# EAGLE schematic smart-tps (EAGLE 9.6.2)
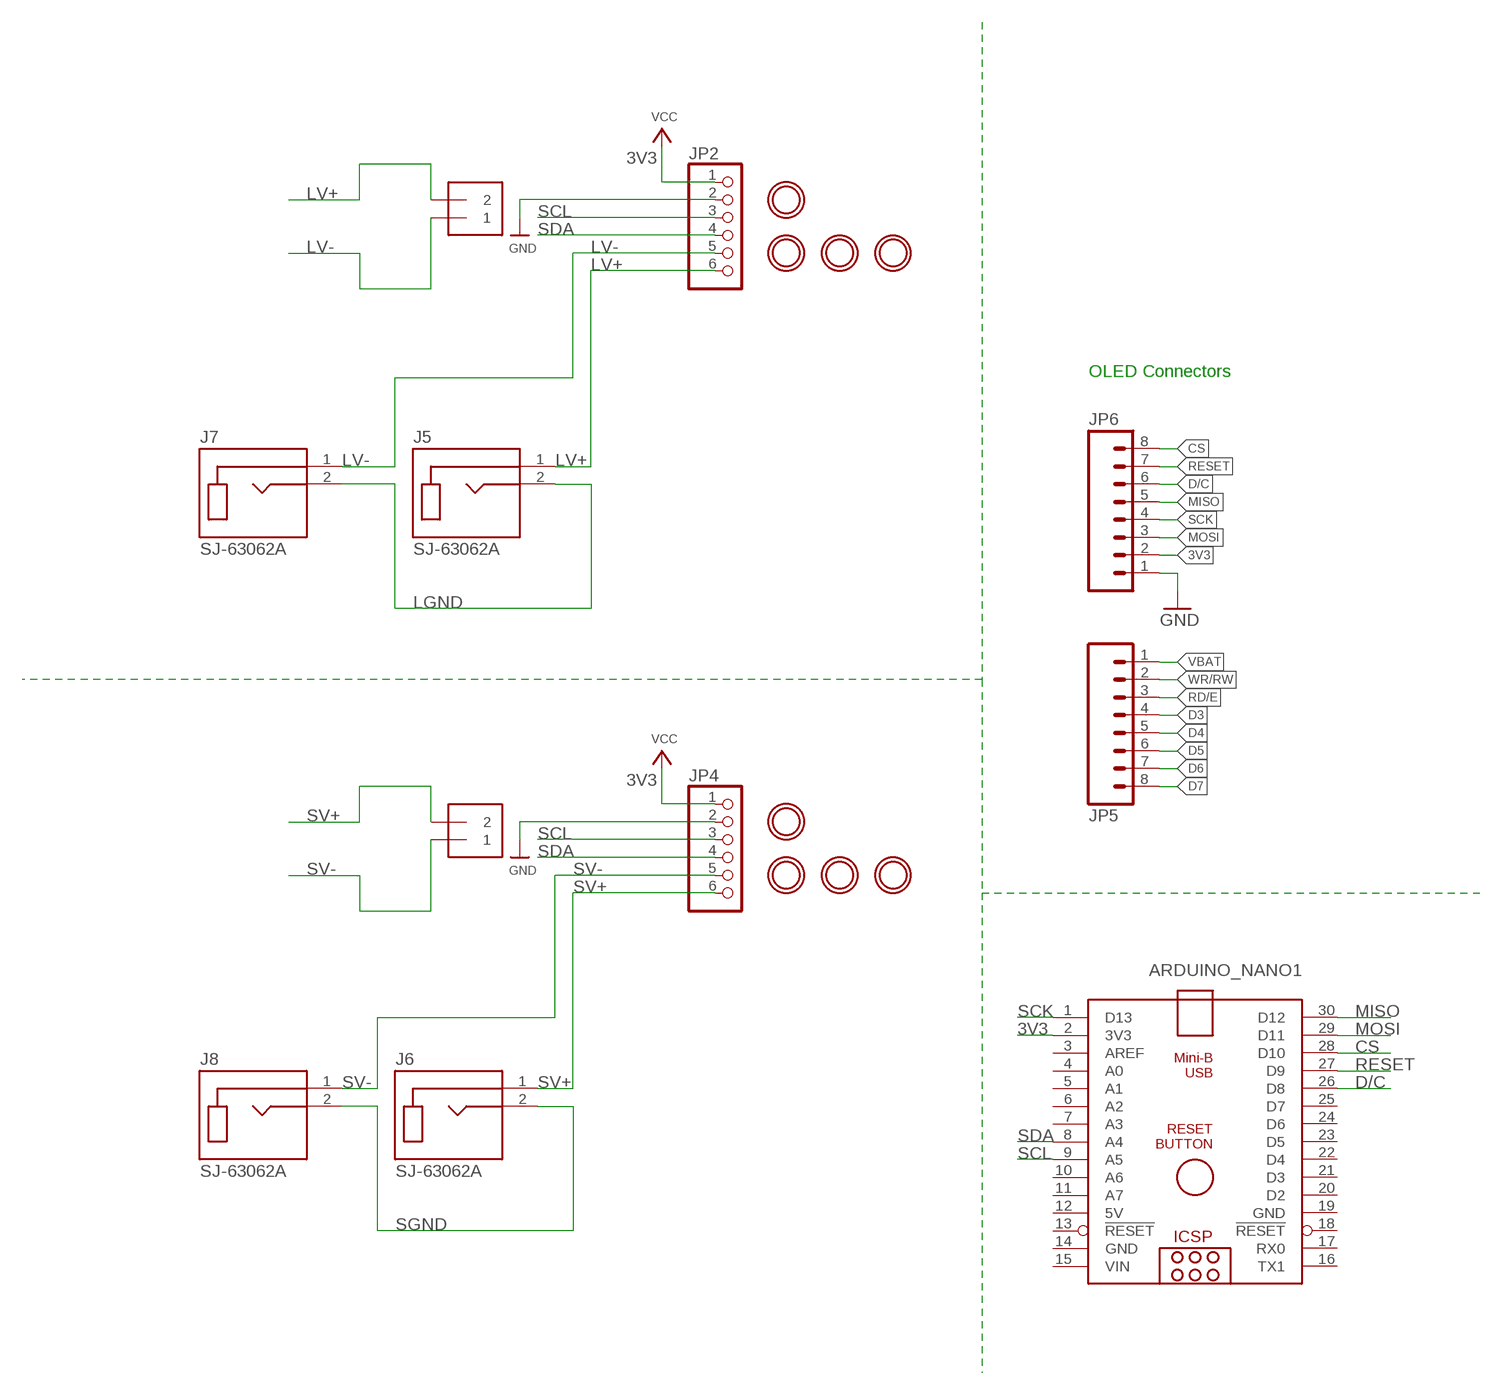
[diagram p0: schematic, sheet 1, part 1 of 2]
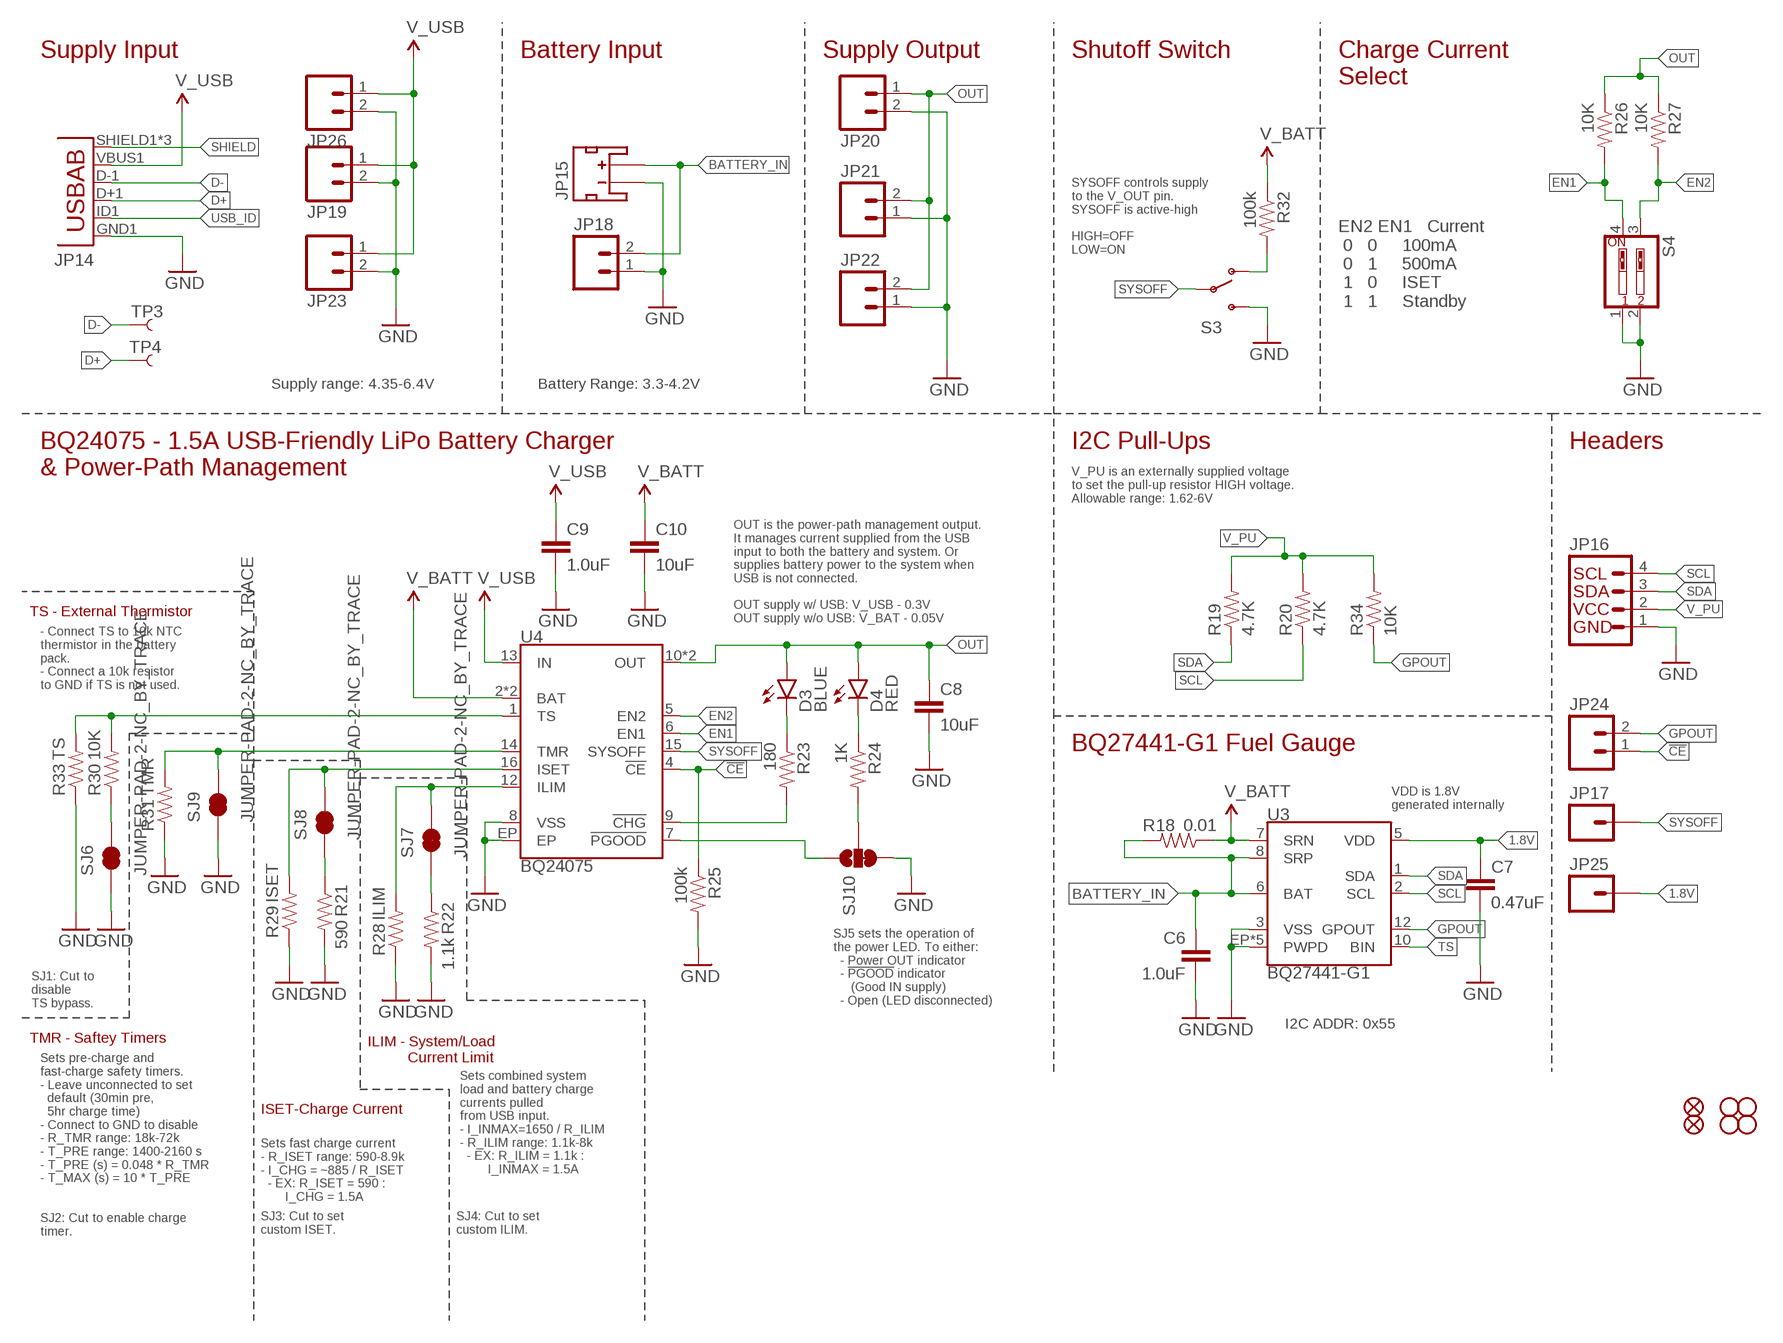
[diagram p1: schematic, sheet 1, part 2 of 2]

## Parts
ARDUINO_NANO1  ARDUINO_NANO  [ARDUINO_NANO]
C6  1.0uF  1.0UF-16V-10%(0603)  [0603-CAP]
C7  0.47uF  CAP0603-CAP  [0603-CAP]
C8  10uF  10UF10V10%(0805)  [0805-CAP]
C9  1.0uF  1.0UF50V10%(1206)  [1206-CAP]
C10  10uF  10UF10V10%(0805)  [0805-CAP]
D3  BLUE  LED-BLUE0603  [LED-0603]
D4  RED  LED-RED0603  [LED-0603]
FID3  FIDUCIAL1X2  [FIDUCIAL-1X2]
FID4  FIDUCIAL1X2  [FIDUCIAL-1X2]
J2  TERMBLOCK_1X2-3.5MM  [1X2-3.5MM]
J4  TERMBLOCK_1X2-3.5MM  [1X2-3.5MM]
J5  SJ-63062A  [CUI_SJ-63062A]
J6  SJ-63062A  [CUI_SJ-63062A]
J7  SJ-63062A  [CUI_SJ-63062A]
J8  SJ-63062A  [CUI_SJ-63062A]
JP2  HEADER-1X670MIL  [1X06_ROUND_70]
JP4  HEADER-1X670MIL  [1X06_ROUND_70]
JP5  M08  [1X08_PIN1_NO_SILK]
JP6  M08  [1X08_PIN1_NO_SILK]
JP14  USB-ABCONN-11794  [USB-AB-MICRO-SMD_V03]
JP15  JST_2MM_MALE  [JST-2-SMD]
JP16  I2C_STANDARD_NO_SILK  [1X04_NO_SILK]
JP17  M01PTH_NO_SILK_YES_STOP  [1X01_NO_SILK]
JP18  M021X02_NO_SILK  [1X02_NO_SILK@1]
JP19  M023.5MM-NO_SILK  [SCREWTERMINAL-3.5MM-2-NS@1]
JP20  M023.5MM-NO_SILK  [SCREWTERMINAL-3.5MM-2-NS@1]
JP21  M021X02_NO_SILK  [1X02_NO_SILK@1]
JP22  M02-JST-2-PTH-NO_SILK  [JST-2-PTH-NS@1]
JP23  M021X02_NO_SILK  [1X02_NO_SILK@1]
JP24  M021X02_NO_SILK  [1X02_NO_SILK@1]
JP25  M01PTH_NO_SILK_YES_STOP  [1X01_NO_SILK]
JP26  M021X02_NO_SILK  [1X02_NO_SILK@1]
R18  0.01  RESISTOR1206  [1206]
R19  4.7K  4.7KOHM-1/10W-1%(0603)  [0603-RES]
R20  4.7K  4.7KOHM-1/10W-1%(0603)  [0603-RES]
R21  590  RESISTOR0603-RES  [0603-RES]
R22  1.1k  RESISTOR0603-RES  [0603-RES]
R23  180  180OHM1/10W1%(0603)  [0603-RES]
R24  1K  1KOHM-1/10W-1%(0603)  [0603-RES]
R25  100k  100KOHM-1/10W-1%(0603)  [0603-RES]
R26  10K  10KOHM-1/10W-1%(0603)0603  [0603-RES]
R27  10K  10KOHM-1/10W-1%(0603)0603  [0603-RES]
R28  ILIM  RESISTORPTH-1/6W  [1/6W-RES]
R29  ISET  RESISTORPTH-1/6W  [1/6W-RES]
R30  10K  10KOHM-1/10W-1%(0603)0603  [0603-RES]
R31  TMR  RESISTORPTH-1/6W  [1/6W-RES]
R32  100k  100KOHM-1/10W-1%(0603)  [0603-RES]
R33  TS  RESISTORPTH-1/6W  [1/6W-RES]
R34  10K  10KOHM-1/10W-1%(0603)0603  [0603-RES]
S3  SWITCH-SPDT-SMD-A  [SWITCH-SPST-SMD-A]
S4  SW_DIP-2-SMT-HALFSIZE  [DIPSWITCH-02-50MIL]
SJ6  JUMPER-PAD-2-NC_BY_TRACE  [PAD-JUMPER-2-NC_BY_TRACE_YES_SILK]
SJ7  JUMPER-PAD-2-NC_BY_TRACE  [PAD-JUMPER-2-NC_BY_TRACE_YES_SILK]
SJ8  JUMPER-PAD-2-NC_BY_TRACE  [PAD-JUMPER-2-NC_BY_TRACE_YES_SILK]
SJ9  JUMPER-PAD-2-NC_BY_TRACE  [PAD-JUMPER-2-NC_BY_TRACE_YES_SILK]
SJ10  JUMPER-PAD-3-2OF3_NC_BY_TRACE_SMALL  [PAD-JUMPER-3-2OF3_NC_BY_TRACE_YES_SILK_FULL_BOX]
STANDOFF5  STAND-OFF  [STAND-OFF]
STANDOFF6  STAND-OFF  [STAND-OFF]
STANDOFF7  STAND-OFF  [STAND-OFF]
STANDOFF8  STAND-OFF  [STAND-OFF]
TP3  TEST-POINT3X4  [PAD.03X.04]
TP4  TEST-POINT3X4  [PAD.03X.04]
U3  BQ27441-G1  [PDSO-N12]
U4  BQ24075  [PVQFN-N16]
U$18  MOUNTINGHOLE2.5  [MOUNTINGHOLE_2.5_PLATED]
U$19  MOUNTINGHOLE2.5  [MOUNTINGHOLE_2.5_PLATED]
U$20  MOUNTINGHOLE2.5  [MOUNTINGHOLE_2.5_PLATED]
U$21  MOUNTINGHOLE2.5  [MOUNTINGHOLE_2.5_PLATED]
U$40  MOUNTINGHOLE2.5  [MOUNTINGHOLE_2.5_PLATED]
U$41  MOUNTINGHOLE2.5  [MOUNTINGHOLE_2.5_PLATED]
U$42  MOUNTINGHOLE2.5  [MOUNTINGHOLE_2.5_PLATED]
U$43  MOUNTINGHOLE2.5  [MOUNTINGHOLE_2.5_PLATED]

## Nets
1.8V: C7.1 JP25.1 U3.5(VDD)
3V3 [power_supply]: ARDUINO_NANO1.2(3V3) JP2.1 JP4.1 JP6.2 ; supply symbol labelled VCC
!CE!: JP24.1 R25.1 U4.4(!CE!)
!CHG!1: R23.2 U4.9(!CHG!)
!PGOOD!1: SJ10.1 U4.7(!PGOOD!)
BATTERY_IN: C6.1 JP15.2(+) JP18.2 R18.2 U3.6(BAT) U3.8(SRP)
CS: ARDUINO_NANO1.28(D10) JP6.8
D3: JP5.4
D4: JP5.5
D5: JP5.6
D6: JP5.7
D7: JP5.8
D+: JP14.D+1(D+) TP4.P$1
D-: JP14.D-1(D-) TP3.P$1
D/C: ARDUINO_NANO1.26(D8) JP6.6
EN1: R26.2 S4.4 U4.6(EN1)
EN2: R27.2 S4.3 U4.5(EN2)
GND: C6.2 C7.2 C8.2 C9.2 C10.2 JP2.2 JP4.2 JP6.1 JP14.GND1(GND) JP15.1(-) JP16.1 JP18.1 JP19.2 JP20.2 JP21.1 JP22.1 JP23.2 JP26.2 R21.2 R22.2 R25.2 R28.1 R29.1 R31.1 R33.1 S3.3(S) S4.1 S4.2 SJ6.1 SJ9.1 SJ10.3 U3.3(VSS) U3.EP1(PWPD) U3.EP2(PWPD) U3.EP3(PWPD) U3.EP4(PWPD) U3.EP(PWPD) U4.8(VSS) U4.EP
GPOUT: JP24.2 R34.1 U3.12(GPOUT)
ILIM1: R28.2 SJ7.2 U4.12(ILIM)
ISET1: R29.2 SJ8.2 U4.16(ISET)
LGND [tool_power]: J5.2(TIP) J7.2(TIP)
LV+ [tool_power]: J2.2 J5.1(SLEEVE) JP2.6
LV- [tool_power]: J2.1 J7.1(SLEEVE) JP2.5
MISO: ARDUINO_NANO1.30(D12) JP6.5
MOSI: ARDUINO_NANO1.29(D11) JP6.3
N$6: D3.C R23.1
N$7: D4.C R24.1
N$8: R32.2 S3.1(O)
N$9: R30.1 SJ6.2
N$10: R22.1 SJ7.1
N$13: R21.1 SJ8.1
N$14: R24.2 SJ10.2
OUT: C8.1 D3.A D4.A JP20.1 JP21.2 JP22.2 R26.1 R27.1 U4.10(OUT) U4.11(OUT)
RD/E: JP5.3
RESET: ARDUINO_NANO1.27(D9) JP6.7
SCK: ARDUINO_NANO1.1(D13) JP6.4
SCL: ARDUINO_NANO1.9(A5) JP2.3 JP4.3 JP16.4 R20.1 U3.2(SCL)
SDA: ARDUINO_NANO1.8(A4) JP2.4 JP4.4 JP16.3 R19.1 U3.1(SDA)
SGND [tool_power]: J6.2(TIP) J8.2(TIP)
SHIELD: JP14.SHIELD1(SHIELD) JP14.SHIELD2(SHIELD) JP14.SHIELD3(SHIELD)
SV+ [tool_power]: J4.2 J6.1(SLEEVE) JP4.6
SV- [tool_power]: J4.1 J8.1(SLEEVE) JP4.5
SYSOFF: JP17.1 S3.2(P) U4.15(SYSOFF)
TMR1: R31.2 SJ9.2 U4.14(TMR)
TS: R30.2 R33.2 U3.10(BIN) U4.1(TS)
USB_ID: JP14.ID1(USBID)
V_BATT: C10.1 R18.1 R32.1 U3.7(SRN) U4.2(BAT) U4.3(BAT)
V_PU: JP16.2 R19.2 R20.2 R34.2
V_USB: C9.1 JP14.VBUS1(VBUS) JP19.1 JP23.1 JP26.1 U4.13(IN)
VBAT: JP5.1
WR/RW: JP5.2
Unconnected: ARDUINO_NANO1.3(AREF) ARDUINO_NANO1.4(A0) ARDUINO_NANO1.5(A1) ARDUINO_NANO1.6(A2) ARDUINO_NANO1.7(A3) ARDUINO_NANO1.10(A6) ARDUINO_NANO1.11(A7) ARDUINO_NANO1.13(!RESET) ARDUINO_NANO1.16(TX1) ARDUINO_NANO1.17(RX0) ARDUINO_NANO1.18(!RESET) ARDUINO_NANO1.20(D2) ARDUINO_NANO1.21(D3) ARDUINO_NANO1.22(D4) ARDUINO_NANO1.23(D5) ARDUINO_NANO1.24(D6) ARDUINO_NANO1.25(D7) JP15.NC1(PAD1) JP15.NC2(PAD2)

## Notes on the sheet
- Supply Input | Battery Input | Supply Output | Shutoff Switch
- Charge Current
  Select
- SYSOFF controls supply 
  to the V_OUT pin.
  SYSOFF is active-high
  
  HIGH=OFF
  LOW=ON
- EN2 EN1   Current
   0   0     100mA
   0   1     500mA
   1   0     ISET
   1   1     Standby
- Supply range: 4.35-6.4V | Battery Range: 3.3-4.2V
- OLED Connectors
- BQ24075 - 1.5A USB-Friendly LiPo Battery Charger 
  & Power-Path Management
- I2C Pull-Ups | Headers
- V_PU is an externally supplied voltage 
  to set the pull-up resistor HIGH voltage.
  Allowable range: 1.62-6V
- OUT is the power-path management output.
  It manages current supplied from the USB 
  input to both the battery and system. Or
  supplies battery power to the system when 
  USB is not connected.
  
  OUT supply w/ USB: V_USB - 0.3V
  OUT supply w/o USB: V_BAT - 0.05V
- TS - External Thermistor
- - Connect TS to 10k NTC 
  thermistor in the battery
  pack.
  - Connect a 10k resistor 
  to GND if TS is not used.
- BQ27441-G1 Fuel Gauge
- VDD is 1.8V
  generated internally
- SJ5 sets the operation of 
  the power LED. To either:
    - Power OUT indicator
    - !PGOOD! indicator 
       (Good IN supply)
    - Open (LED disconnected)
- SJ1: Cut to 
  disable
  TS bypass.
- I2C ADDR: 0x55
- TMR - Saftey Timers
- ILIM - System/Load 
            Current Limit
- Sets pre-charge and
  fast-charge safety timers.
  - Leave unconnected to set
    default (30min pre, 
    5hr charge time)
  - Connect to GND to disable
  - R_TMR range: 18k-72k
  - T_PRE range: 1400-2160 s
  - T_PRE (s) = 0.048 * R_TMR
  - T_MAX (s) = 10 * T_PRE
- Sets combined system
  load and battery charge 
  currents pulled
  from USB input.
  - I_INMAX=1650 / R_ILIM
  - R_ILIM range: 1.1k-8k
    - EX: R_ILIM = 1.1k : 
          I_INMAX = 1.5A
- ISET-Charge Current
- Sets fast charge current
  - R_ISET range: 590-8.9k
  - I_CHG = ~885 / R_ISET
    - EX: R_ISET = 590 : 
         I_CHG = 1.5A
- SJ3: Cut to set
  custom ISET.
- SJ4: Cut to set
  custom ILIM.
- SJ2: Cut to enable charge
  timer.

## Power pins joined to a net without a drawn wire
5V: ARDUINO_NANO1.12(5V)
GND: ARDUINO_NANO1.14(GND) ARDUINO_NANO1.19(GND)
VIN: ARDUINO_NANO1.15(VIN)

## Library data of the parts
ARDUINO_NANO1 = ArduinoNanoV30:ARDUINO_NANO: Arduino Nano V3.0 Overview: The Arduino Nano is a small, complete, and breadboard-friendly board based on the ATmega328 (Arduino Nano 3.x) or ATmega168 (Arduino Nano 2.x). It has more or less the same functionality of the Arduino Duemilanove, but in a different package. It lacks only a DC power jack, and works with a Mini-B USB cable instead of a standard one. The Nano was designed and is being produced by Gravitech. Specifications: Microcontroller Atmel ATmega168 or ATmega328 Operating Voltage (logic level) 5 V Input Voltage (recommended) 7-12 V Input Voltage (limits) 6-20 V Digital I/O Pins 14 (of which 6 provide PWM output) Analog Input Pins 8 DC Current per I/O Pin 40 mA Flash Memory 16 KB (ATmega168) or 32 KB (ATmega328) of which 2 KB used by bootloader SRAM 1 KB (ATmega168) or 2 KB (ATmega328) EEPROM 512 bytes (ATmega168) or 1 KB (ATmega328) Clock Speed 16 MHz Dimensions 0.73" x 1.70" Length 45 mm Width 18 mm Weigth 5 g Power: The Arduino Nano can be powered via the Mini-B USB connection, 6-20V unregulated external power supply (pin 30), or 5V regulated external power supply (pin 27). The power source is automatically selected to the highest voltage source. Memory: The ATmega168 has 16 KB of flash memory for storing code (of which 2 KB is used for the bootloader); the ATmega328 has 32 KB, (also with 2 KB used for the bootloader). The ATmega168 has 1 KB of SRAM and 512 bytes of EEPROM (which can be read and written with the EEPROM library); the ATmega328 has 2 KB of SRAM and 1 KB of EEPROM. Input and Output: Each of the 14 digital pins on the Nano can be used as an input or output, using pinMode(), digitalWrite(), and digitalRead() functions. They operate at 5 volts. Each pin can provide or receive a maximum of 40 mA and has an internal pull-up resistor (disconnected by default) of 20-50 kOhms. In addition, some pins have specialized functions. Visit Arduino - ArduinoBoardNano <https://www.arduino.cc/en/Main/ArduinoBoardNano>
C6 = SparkFun-Capacitors:1.0UF-16V-10%(0603): CAP-00868; PROD_ID: CAP-00868
C7 = SparkFun-Capacitors:CAP: Capacitor Standard 0603 ceramic capacitor, and 0.1" leaded capacitor.; PROD_ID: CAP-13216
C8 C10 = SparkFun-Capacitors:10UF10V10%(0805): CAP-11330; PROD_ID: CAP-11330
C9 = SparkFun-Capacitors:1.0UF50V10%(1206): CAP-09822; PROD_ID: CAP-09822
D3 = SparkFun-LED:LED-BLUE: Blue LEDs for production use Various blue LEDs stocked by SparkFun production 0603 - DIO-08575 Rebel - DIO-09553 1206 - DIO-09911; PROD_ID: DIO-08575
D4 = SparkFun-LED:LED-RED: Assorted Red LEDs LilyPad 1206- DIO-09912 1206- DIO-00809 0603- DIO-00819 "SMART" means more efficient and expensive; PROD_ID: DIO-00819
FID3 FID4 = SparkFun-Aesthetics:FIDUCIAL: Fiducial Alignment Points Various fiducial points for machine vision alignment.
J2 J4 = microbuilder:TERMBLOCK_1X2: 3.5mm Terminal block http://www.ladyada.net/library/pcb/eaglelibrary.html
J5-J8 = SJ-63062A:SJ-63062A; CUI_PURCHASE_URL: https://www.cuidevices.com/product/interconnect/connectors/audio-connectors/jacks/sj-6306-series?utm_source=snapeda.com&utm_medium=referral&utm_campaign=snapedaBOM; DESCRIPTION: 6.35 mm, Mono and Stereo, Right Angle, Through Hole, 2~3 Conductors, 0~1 Internal Switches, Audio Jack Connector; DIGI-KEY_PART_NUMBER: 2223-SJ-63062A-ND; MF: CUI Devices; MP: SJ-63062A; PACKAGE: Package; PURCHASE-URL: https://pricing.snapeda.com/search/part/SJ-63062A/?ref=eda
JP2 JP4 = microbuilder:HEADER-1X6: PIN HEADER
JP5 JP6 = SparkFun-Connectors:M08: Header 8 Standard 8-pin 0.1" header. Use with straight break away headers (SKU : PRT-00116), right angle break away headers (PRT-00553), swiss pins (PRT-00743), machine pins (PRT-00117), and female headers (PRT-00115).
JP14 = SparkFun-Connectors:USB-AB: This is a USB AB connector that is compatible with USB OTG. i.e. this connector can serve as a host or device; PROD_ID: CONN-11794
JP15 = SparkFun-Connectors:JST_2MM_MALE: Mates to single-cell LiPo batteries. CONN-11443 Now with smashable polarity marks!; BTM_NEG: -; BTM_POS: +; PROD_ID: CONN-11443; TOP_NEG: -; TOP_POS: +
JP16 = SparkFun-Connectors:I2C_STANDARD: SparkFun has standardized on a pinout for all I2C based sensor breakouts. This pinout allows I2C boards to be plugged directly into the headers on Arduino Uno compatible boards, and to be daisy chained easily.
JP17 JP25 = SparkFun-Connectors:M01: Header 1 Standard 1-pin 0.1" header. Use with straight break away headers (SKU : PRT-00116), right angle break away headers (PRT-00553), swiss pins (PRT-00743), machine pins (PRT-00117), and female headers (PRT-00115).
JP18 JP21-JP24 JP26 = SparkFun-Connectors:M02: Standard 2-pin 0.1" header. Use with - straight break away headers ( PRT-00116) - right angle break away headers (PRT-00553) - swiss pins (PRT-00743) - machine pins (PRT-00117) - female headers (PRT-00115) Molex polarized connector foot print use with: PRT-08233 with associated crimp pins and housings. 2.54_SCREWTERM for use with PRT-10571. 3.5mm Screw Terminal footprints for PRT-08084 5mm Screw Terminal footprints for use with PRT-08432
JP19 JP20 = SparkFun-Connectors:M02: Standard 2-pin 0.1" header. Use with - straight break away headers ( PRT-00116) - right angle break away headers (PRT-00553) - swiss pins (PRT-00743) - machine pins (PRT-00117) - female headers (PRT-00115) Molex polarized connector foot print use with: PRT-08233 with associated crimp pins and housings. 2.54_SCREWTERM for use with PRT-10571. 3.5mm Screw Terminal footprints for PRT-08084 5mm Screw Terminal footprints for use with PRT-08432; PROD_ID: CONN-08399
R18 = SparkFun-Resistors:RESISTOR: Resistor Basic schematic elements and footprints for 0603, 1206, and PTH resistors.; PROD_ID: RES-13218
R19 R20 = SparkFun-Resistors:4.7KOHM-1/10W-1%(0603): RES-07857; PROD_ID: RES-07857
R21 = SparkFun-Passives:RESISTOR: Resistor Basic schematic elements and footprints for 0603, 1206, and PTH resistors.; PROD_ID: RES-13217
R22 = SparkFun-Passives:RESISTOR: Resistor Basic schematic elements and footprints for 0603, 1206, and PTH resistors.; PROD_ID: RES-10447
R23 = SparkFun-Resistors:180OHM1/10W1%(0603): RES-08788; PROD_ID: RES-08788
R24 = SparkFun-Resistors:1KOHM-1/10W-1%(0603): RES-07856; PROD_ID: RES-07856
R25 R32 = SparkFun-Resistors:100KOHM-1/10W-1%(0603): RES-07828; PROD_ID: RES-07828
R26 R27 R30 R34 = SparkFun-Resistors:10KOHM-1/10W-1%(0603): RES-00824; PROD_ID: RES-00824
R28 R29 R31 R33 = SparkFun-Resistors:RESISTOR: Resistor Basic schematic elements and footprints for 0603, 1206, and PTH resistors.
S3 = SparkFun-Electromechanical:SWITCH-SPDT: SPDT Switch Simple slide switch, Spark Fun Electronics SKU : COM-00102 DPDT SMT slide switch, AYZ0202, SWCH-08179; PROD_ID: SWCH-10651
S4 = SparkFun-Electromechanical:SW_DIP-2: DIP SWITCH; PROD_ID: SWCH-13215
SJ6-SJ9 = SparkFun-Passives:JUMPER-PAD-2-NC_BY_TRACE
SJ10 = SparkFun-Passives:JUMPER-PAD-3-2OF3_NC_BY_TRACE
STANDOFF5-STANDOFF8 = SparkFun-Electromechanical:STAND-OFF: #4 Stand Off This is the mechanical footprint for a #4 phillips button head screw. Use the keepout ring to avoid running the screw head into surrounding components. SKU : PRT-00447
TP3 TP4 = SparkFun-Passives:TEST-POINT: Bare copper test points for troubleshooting or ICT
U3 = battery-management-temp:BQ27441-G1; PROD_ID: IC-13220
U4 = battery-management-temp:BQ24075; PROD_ID: IC-13219
U$18-U$21 U$40-U$43 = microbuilder:MOUNTINGHOLE: Mounting Hole For #2 screws (0.086"/2.18mm width, 0.094"/2.4mm hole) use 2.5mm

## Net classes
0 default: width 0.61 mm, clearance 0.305 mm
1 tool_power: width 1.524 mm, drill 0.356 mm, clearance 0.406 mm
2 power_supply: width 0.762 mm, clearance 0.305 mm
3 12_mil: width 0.305 mm